# Altium schematic sheet GyroAccelHeaders.SchDoc
size A
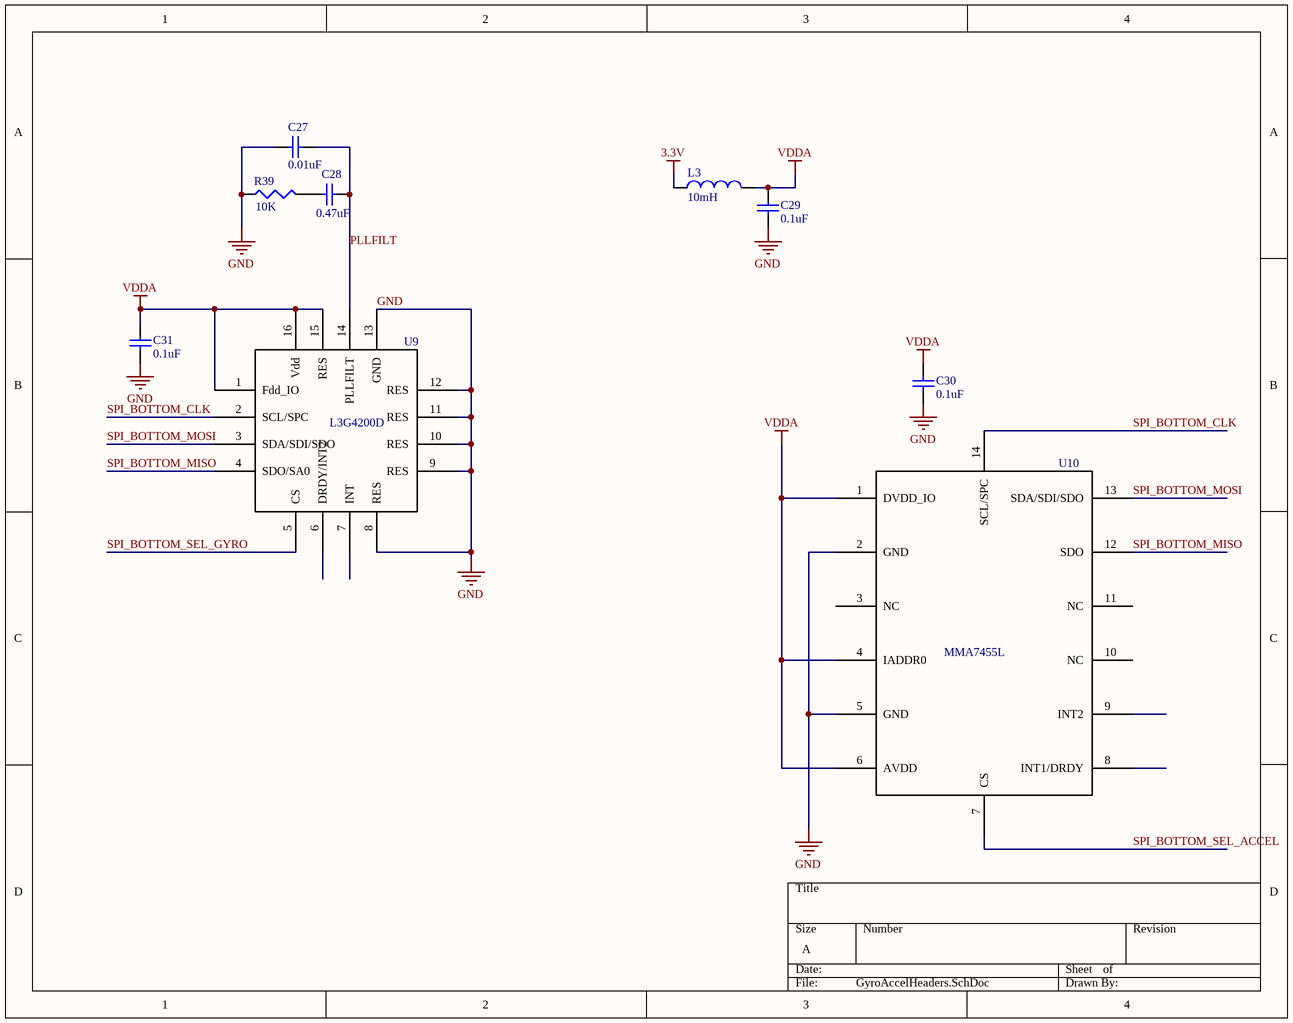
[diagram p0: GyroAccelHeaders.SchDoc]

## Parts
C27  value 0.01uF  [CAPC1005L]  (hidden comment: Cap Semi)
C28  value 0.47uF  [CAPC1005L]  (hidden comment: Cap Semi)
C29  value 0.1uF  [CAPC1005L]  (hidden comment: Cap Semi)
C30  value 0.1uF  [CAPC1005L]  (hidden comment: Cap Semi)
C31  value 0.1uF  [CAPC1005L]  (hidden comment: Cap Semi)
L3  value 10mH  [INDC2012L]  (hidden comment: Inductor)
R39  value 10K  [RESC1608L]  (hidden comment: Res3)
U9  L3G4200D  [L3G2004D]
U10  MMA7455L  [MMA7455L]

## Nets
3.3V: L3.2
GND: C27.2 C29.1 C30.1 C31.1 R39.1 U9.8(RES) U9.9(RES) U9.10(RES) U9.11(RES) U9.12(RES) U9.13(GND) U10.2(GND) U10.5(GND)
VDDA: C29.2 C30.2 C31.2 L3.1 U9.1(Fdd_IO) U9.15(RES) U9.16(Vdd) U10.1(DVDD_IO) U10.4(IADDR0) U10.6(AVDD)
PLLFILT: C27.1 C28.1 U9.14(PLLFILT)
SPI_BOTTOM_CLK: U9.2(SCL/SPC) U10.14(SCL/SPC)
SPI_BOTTOM_MISO: U9.4(SDO/SA0) U10.12(SDO)
SPI_BOTTOM_MOSI: U9.3(SDA/SDI/SDO) U10.13(SDA/SDI/SDO)
SPI_BOTTOM_SEL_ACCEL: U10.7(CS)
SPI_BOTTOM_SEL_GYRO: U9.5(CS)
NetC28_2: C28.2 R39.2

Not connected (* = marked no-connect by the designer): U9 6(DRDY/INT2) 7(INT); U10 3(NC) 8(INT1/DRDY) 9(INT2) 10(NC) 11(NC)

## Library data of the parts
C27-C31 = Cap Semi: Capacitor (Semiconductor SIM Model); Published: 8-Jun-2000; LatestRevisionDate: 29-May-2009; LatestRevisionNote: IPC-7351 Footprint Added.; PackageReference: C1206; Publisher: Altium Limited; PackageDescription: Chip Capacitor
L3 = Inductor: Code_IEC: 1005; Published: 8-Jun-2000; LatestRevisionDate: 29-May-2009; LatestRevisionNote: IPC-7351 Footprint Added.; PackageReference: 0402-A; Publisher: Altium Limited; PackageDescription: Chip Inductor; Code_JEITA: 0402
R39 = Res3: Resistor; Published: 8-Jun-2000; LatestRevisionDate: 29-May-2009; LatestRevisionNote: IPC-7351 Footprint Added.; PackageReference: J1-0603; Publisher: Altium Limited; PackageDescription: Chip Resistor
U9 = L3G4200D: 3axis gyroscope, SPI
U10 = MMA7455L: 3axis accelerometer